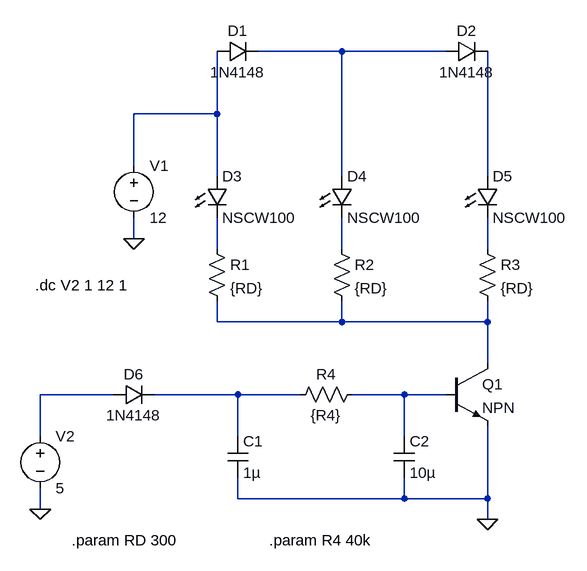
[diagram p0: schematic SimpleVuMeter1.asc]
SimpleVuMeter1.asc, the LTspice schematic file:
Version 4
SHEET 1 880 816
WIRE 336 -32 208 -32
WIRE 496 -32 336 -32
WIRE 144 64 144 -32
WIRE 144 64 16 64
WIRE 16 144 16 64
WIRE 144 160 144 64
WIRE 336 160 336 -32
WIRE 560 160 560 -32
WIRE 16 256 16 224
WIRE 144 272 144 224
WIRE 336 272 336 224
WIRE 560 272 560 224
WIRE 144 384 144 352
WIRE 336 384 336 352
WIRE 336 384 144 384
WIRE 560 384 560 352
WIRE 560 384 336 384
WIRE 560 448 560 384
WIRE -16 496 -128 496
WIRE 176 496 48 496
WIRE 272 496 176 496
WIRE 432 496 352 496
WIRE 496 496 432 496
WIRE -128 560 -128 496
WIRE 176 560 176 496
WIRE 432 560 432 496
WIRE 176 656 176 624
WIRE 432 656 432 624
WIRE 432 656 176 656
WIRE 560 656 560 544
WIRE 560 656 432 656
WIRE -128 672 -128 640
WIRE 560 688 560 656
FLAG 560 688 0
FLAG -128 672 0
FLAG 16 256 0
SYMBOL voltage 16 128 R0
WINDOW 123 0 0 Left 0
WINDOW 39 0 0 Left 0
SYMATTR InstName V1
SYMATTR Value 12
SYMBOL diode 144 -16 R270
WINDOW 0 32 32 VTop 2
WINDOW 3 0 32 VBottom 2
SYMATTR InstName D1
SYMATTR Value 1N4148
SYMBOL LED 128 160 R0
SYMATTR InstName D3
SYMATTR Value NSCW100
SYMATTR Description Diode
SYMATTR Type diode
SYMBOL cap 160 560 R0
SYMATTR InstName C1
SYMATTR Value 1µ
SYMBOL cap 416 560 R0
SYMATTR InstName C2
SYMATTR Value 10µ
SYMBOL LED 320 160 R0
SYMATTR InstName D4
SYMATTR Value NSCW100
SYMATTR Description Diode
SYMATTR Type diode
SYMBOL LED 544 160 R0
SYMATTR InstName D5
SYMATTR Value NSCW100
SYMATTR Description Diode
SYMATTR Type diode
SYMBOL diode 496 -16 R270
WINDOW 0 32 32 VTop 2
WINDOW 3 0 32 VBottom 2
SYMATTR InstName D2
SYMATTR Value 1N4148
SYMBOL diode -16 512 R270
WINDOW 0 32 32 VTop 2
WINDOW 3 0 32 VBottom 2
SYMATTR InstName D6
SYMATTR Value 1N4148
SYMBOL res 128 256 R0
SYMATTR InstName R1
SYMATTR Value {RD}
SYMBOL res 320 256 R0
SYMATTR InstName R2
SYMATTR Value {RD}
SYMBOL res 544 256 R0
SYMATTR InstName R3
SYMATTR Value {RD}
SYMBOL res 368 480 R90
WINDOW 0 0 56 VBottom 2
WINDOW 3 32 56 VTop 2
SYMATTR InstName R4
SYMATTR Value {R4}
SYMBOL npn 496 448 R0
SYMATTR InstName Q1
SYMBOL voltage -128 544 R0
WINDOW 123 0 0 Left 0
WINDOW 39 0 0 Left 0
SYMATTR InstName V2
SYMATTR Value 5
TEXT -136 328 Left 2 !.dc V2 1 12 1
TEXT -80 720 Left 2 !.param RD 300
TEXT 224 720 Left 2 !.param R4 40k

The netlist it stands for:
* SimpleVuMeter1.asc
V1 N002 0 12
D1 N002 N001 1N4148
D3 N002 N004 NSCW100
C1 N009 0 1µ
C2 N010 0 10µ
D4 N001 N005 NSCW100
D5 N003 N006 NSCW100
D2 N001 N003 1N4148
D6 N008 N009 1N4148
R1 N004 N007 {RD}
R2 N005 N007 {RD}
R3 N006 N007 {RD}
R4 N010 N009 {R4}
Q1 N007 N010 0 0 NPN
V2 N008 0 5
.model D D
.lib standard.dio
.model NPN NPN
.model PNP PNP
.lib standard.bjt
.dc V2 1 12 1
.param RD 300
.param R4 40k
.backanno
.end